# EAGLE design veils_v40 (EAGLE 9.7.0)

## Sheet 1 of 5
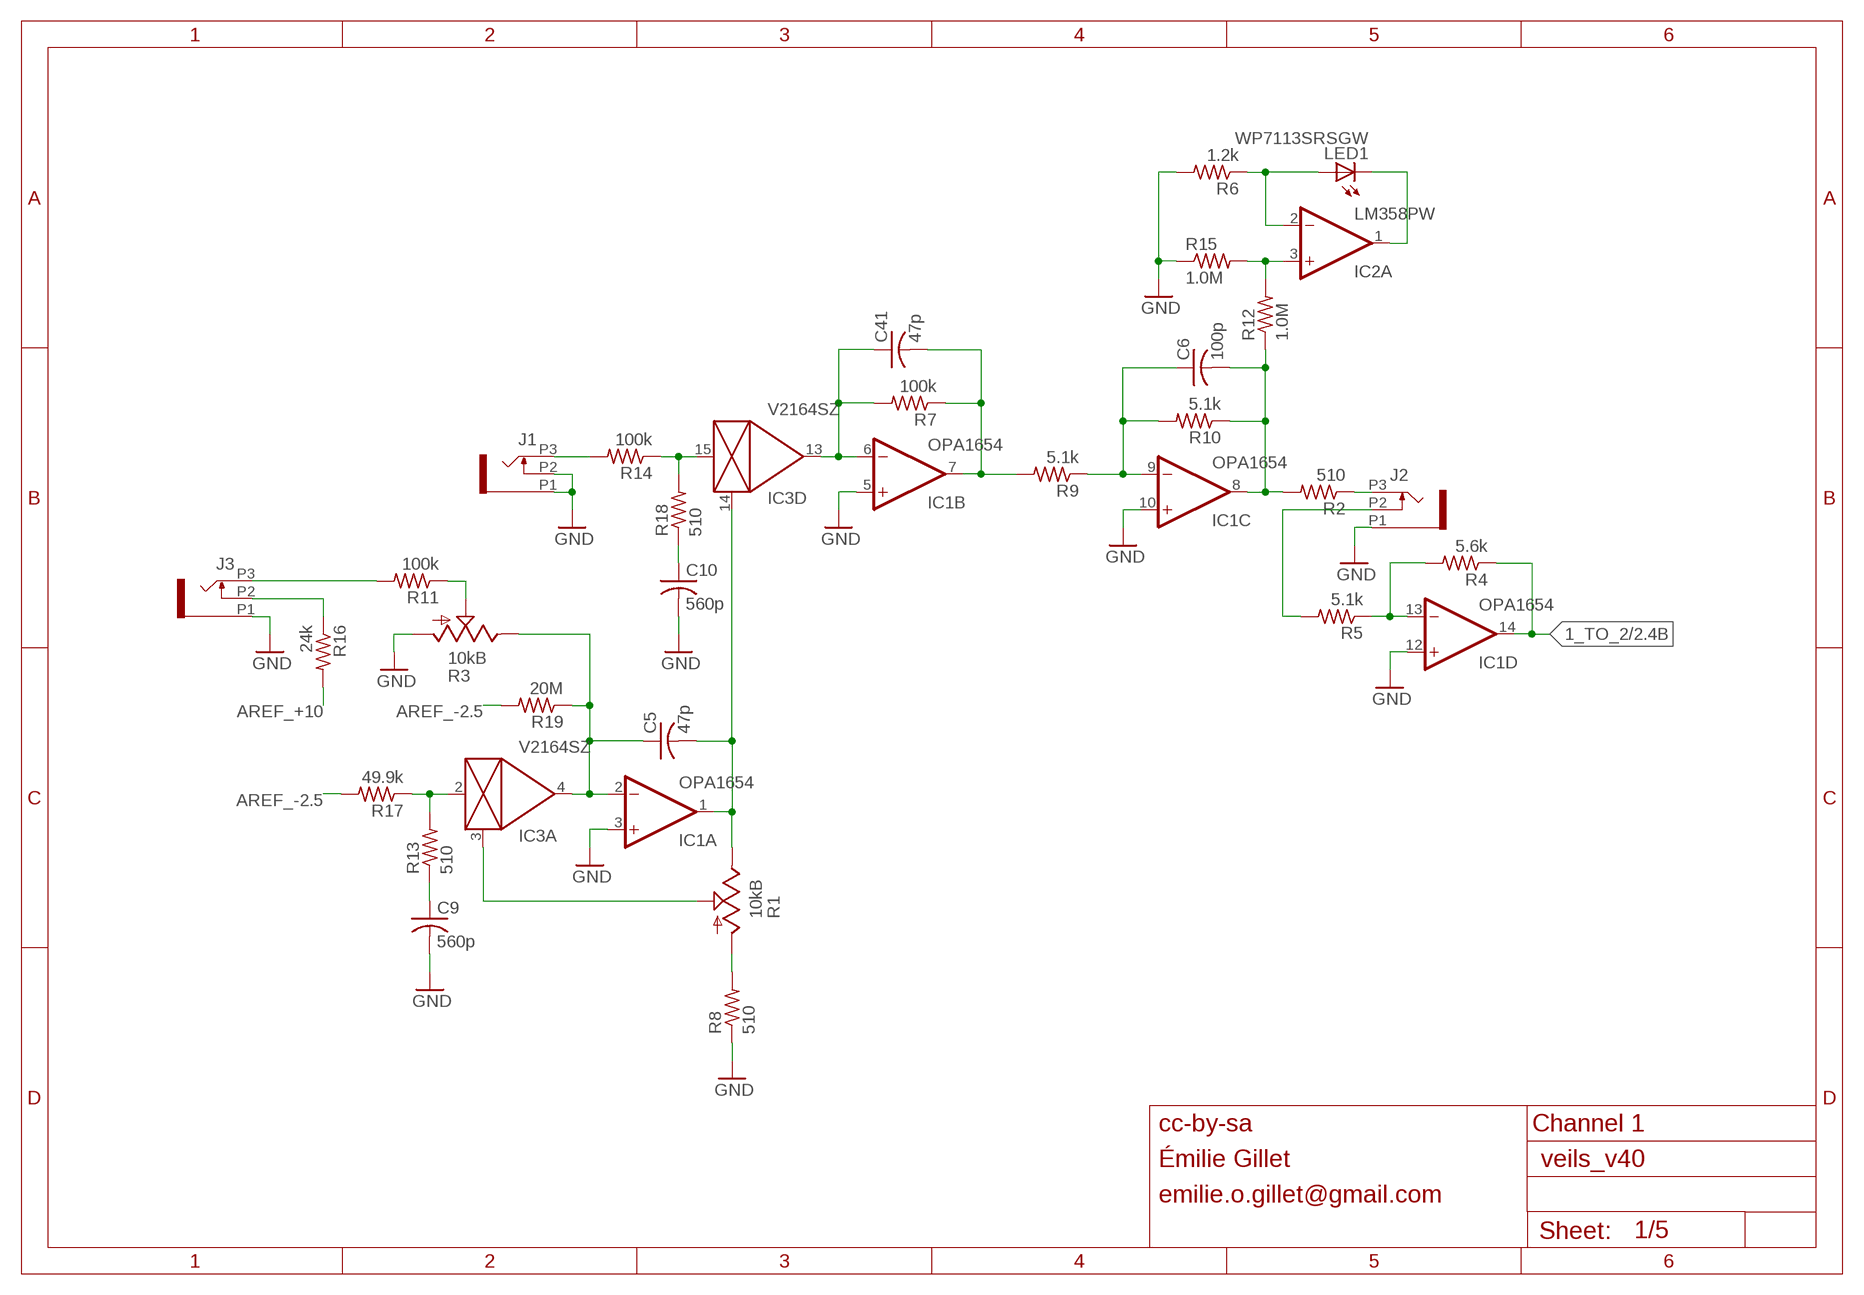
[diagram p0: schematic, sheet 1]

### Parts
C5  47p  C-USC0402  [C0402]
C6  100p  C-USC0402  [C0402]
C9  560p  C-USC0402  [C0402]
C10  560p  C-USC0402  [C0402]
C41  47p  C-USC0402  [C0402]
IC1  OPA1654  TL074PW  [TSSOP14]
IC2  LM358PW  TL072PW  [TSSOP8]
IC3  V2164SZ  SSM2164S  [SOIC16N]
J1  PJ301_THONKICONN6  [WQP_PJ_301M6]
J2  PJ301_THONKICONN6  [WQP_PJ_301M6]
J3  PJ301_THONKICONN6  [WQP_PJ_301M6]
LED1  WP7113SRSGW  LED5MM  [LED5MM]
R1  10kB  POT_USVERTICAL  [ALPS_POT_VERTICAL]
R2  510  R-US_R0402  [R0402]
R3  10kB  POT_USVERTICAL_PS  [ALPS_POT_VERTICAL_PS]
R4  5.6k  R-US_R0402  [R0402]
R5  5.1k  R-US_R0402  [R0402]
R6  1.2k  R-US_R0402  [R0402]
R7  100k  R-US_R0402  [R0402]
R8  510  R-US_R0402  [R0402]
R9  5.1k  R-US_R0402  [R0402]
R10  5.1k  R-US_R0402  [R0402]
R11  100k  R-US_R0402  [R0402]
R12  1.0M  R-US_R0402  [R0402]
R13  510  R-US_R0402  [R0402]
R14  100k  R-US_R0402  [R0402]
R15  1.0M  R-US_R0402  [R0402]
R16  24k  R-US_R0402  [R0402]
R17  49.9k  R-US_R0402  [R0402]
R18  510  R-US_R0402  [R0402]
R19  20M  R-US_R0402  [R0402]

### Nets
1_TO_2: IC1.14(D:OUT) R4.1 ; also sheet 2
AREF_+10: R16.2 ; also sheet 2,3,4,5
AREF_-2.5: R17.2 R19.2 ; also sheet 2,3,4,5
CV_IN_1: J3.P3 R11.2
FOO: IC3.2(A:IN) R13.2 R17.1
GND: C9.2 C10.2 IC1.3(A:+IN) IC1.5(B:+IN) IC1.10(C:+IN) IC1.12(D:+IN) J1.P1 J1.P2 J2.P1 J3.P1 R3.P$3(A) R6.2 R8.1 R15.1 ; also sheet 2,3,4,5
N$1: IC2.3(A:+IN) R12.2 R15.2
N$7: J2.P3 R2.1
N$9: IC3.3(A:CTRL) R1.P$2(S)
N$10: C6.1 IC1.9(C:-IN) R9.1 R10.2
N$14: R3.P$2(S) R11.1
N$15: R1.P$3(A) R8.2
N$18: IC2.1(A:OUT) LED1.K(C)
N$19: IC2.2(A:-IN) LED1.A R6.1
N$20: C9.1 R13.1
N$21: J3.P2 R16.1
N$22: IC1.13(D:-IN) R4.2 R5.1
N$25: J2.P2 R5.2
N$47: C10.1 R18.1
N$65: C5.1 IC1.2(A:-IN) IC3.4(A:OUT) R3.P$1(E) R19.1
N$66: J1.P3 R14.2
N$75: IC3.15(D:IN) R14.1 R18.2
N$87: C5.2 IC1.1(A:OUT) IC3.14(D:CTRL) R1.P$1(E)
N$96: C41.1 IC1.6(B:-IN) IC3.13(D:OUT) R7.2
N$100: C41.2 IC1.7(B:OUT) R7.1 R9.2
OUT1: C6.2 IC1.8(C:OUT) R2.2 R10.1 R12.1

### Notes on the sheet
- cc-by-sa | Channel 1
- Émilie Gillet
- emilie.o.gillet@gmail.com

## Sheet 2 of 5
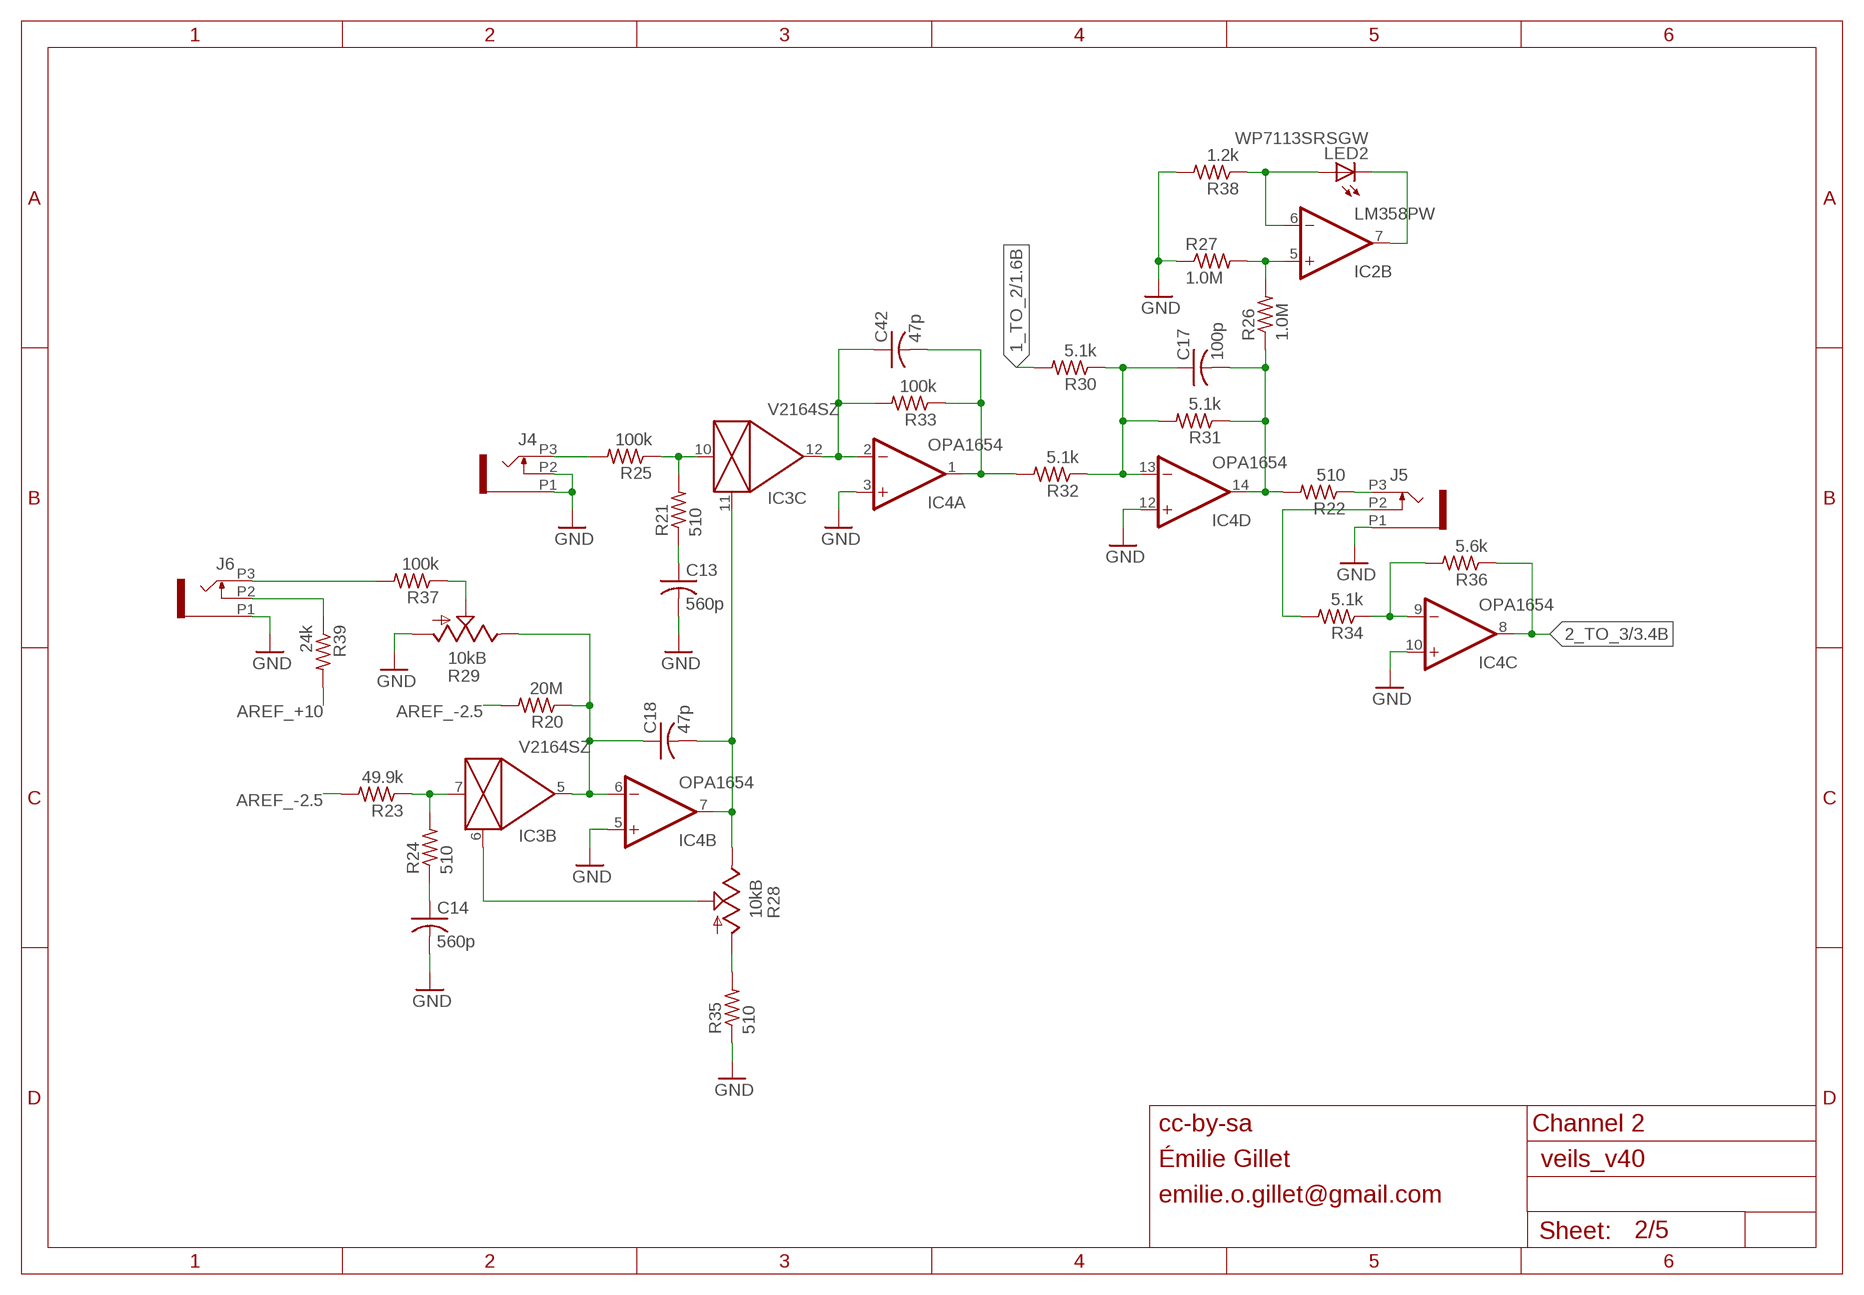
[diagram p1: schematic, sheet 2]

### Parts
C13  560p  C-USC0402  [C0402]
C14  560p  C-USC0402  [C0402]
C17  100p  C-USC0402  [C0402]
C18  47p  C-USC0402  [C0402]
C42  47p  C-USC0402  [C0402]
IC4  OPA1654  TL074PW  [TSSOP14]
J4  PJ301_THONKICONN6  [WQP_PJ_301M6]
J5  PJ301_THONKICONN6  [WQP_PJ_301M6]
J6  PJ301_THONKICONN6  [WQP_PJ_301M6]
LED2  WP7113SRSGW  LED5MM  [LED5MM]
R20  20M  R-US_R0402  [R0402]
R21  510  R-US_R0402  [R0402]
R22  510  R-US_R0402  [R0402]
R23  49.9k  R-US_R0402  [R0402]
R24  510  R-US_R0402  [R0402]
R25  100k  R-US_R0402  [R0402]
R26  1.0M  R-US_R0402  [R0402]
R27  1.0M  R-US_R0402  [R0402]
R28  10kB  POT_USVERTICAL  [ALPS_POT_VERTICAL]
R29  10kB  POT_USVERTICAL_PS  [ALPS_POT_VERTICAL_PS]
R30  5.1k  R-US_R0402  [R0402]
R31  5.1k  R-US_R0402  [R0402]
R32  5.1k  R-US_R0402  [R0402]
R33  100k  R-US_R0402  [R0402]
R34  5.1k  R-US_R0402  [R0402]
R35  510  R-US_R0402  [R0402]
R36  5.6k  R-US_R0402  [R0402]
R37  100k  R-US_R0402  [R0402]
R38  1.2k  R-US_R0402  [R0402]
R39  24k  R-US_R0402  [R0402]

### Nets
1_TO_2: R30.2 ; also sheet 1
2_TO_3: IC4.8(C:OUT) R36.1 ; also sheet 3
AREF_+10: R39.2 ; also sheet 1,3,4,5
AREF_-2.5: R20.2 R23.2 ; also sheet 1,3,4,5
FOO1: IC3.7(B:IN) R23.1 R24.2
GND: C13.2 C14.2 IC4.3(A:+IN) IC4.5(B:+IN) IC4.10(C:+IN) IC4.12(D:+IN) J4.P1 J4.P2 J5.P1 J6.P1 R27.1 R29.P$3(A) R35.1 R38.2 ; also sheet 1,3,4,5
N$3: J4.P3 R25.2
N$4: IC2.5(B:+IN) R26.2 R27.2
N$6: J5.P3 R22.1
N$17: C13.1 R21.1
N$24: IC3.10(C:IN) R21.2 R25.1
N$26: IC3.6(B:CTRL) R28.P$2(S)
N$27: C17.1 IC4.13(D:-IN) R30.1 R31.2 R32.1
N$28: C18.2 IC3.11(C:CTRL) IC4.7(B:OUT) R28.P$1(E)
N$32: R28.P$3(A) R35.2
N$35: IC2.7(B:OUT) LED2.K(C)
N$36: IC2.6(B:-IN) LED2.A R38.1
N$37: IC4.9(C:-IN) R34.1 R36.2
N$38: J5.P2 R34.2
N$39: C42.2 IC4.1(A:OUT) R32.2 R33.1
N$40: R29.P$2(S) R37.1
N$41: C14.1 R24.1
N$42: C18.1 IC3.5(B:OUT) IC4.6(B:-IN) R20.1 R29.P$1(E)
N$44: J6.P3 R37.2
N$53: C42.1 IC3.12(C:OUT) IC4.2(A:-IN) R33.2
N$64: J6.P2 R39.1
OUT2: C17.2 IC4.14(D:OUT) R22.2 R26.1 R31.1

### Notes on the sheet
- cc-by-sa | Channel 2
- Émilie Gillet
- emilie.o.gillet@gmail.com

## Sheet 3 of 5
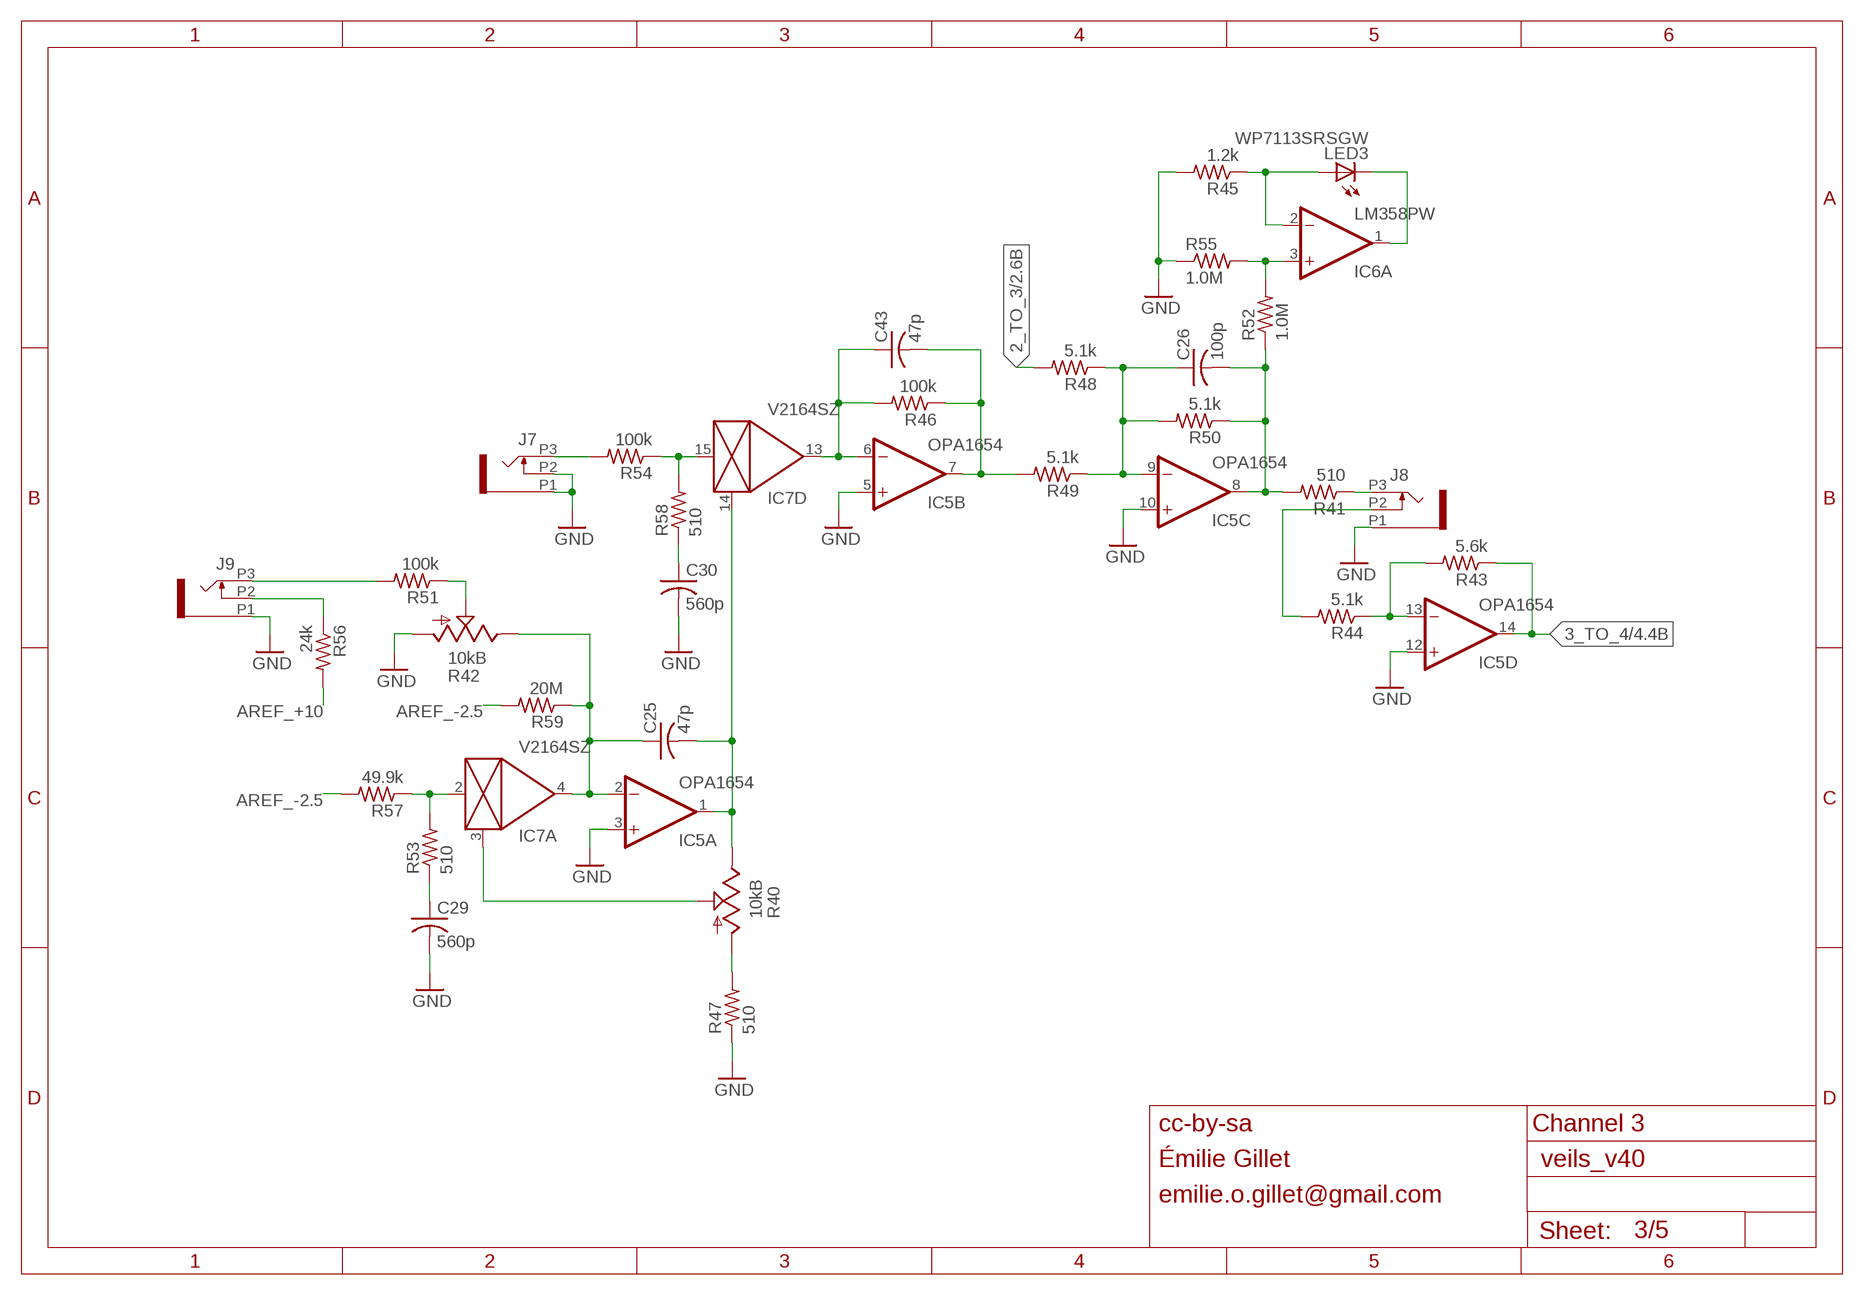
[diagram p2: schematic, sheet 3]

### Parts
C25  47p  C-USC0402  [C0402]
C26  100p  C-USC0402  [C0402]
C29  560p  C-USC0402  [C0402]
C30  560p  C-USC0402  [C0402]
C43  47p  C-USC0402  [C0402]
IC5  OPA1654  TL074PW  [TSSOP14]
IC6  LM358PW  TL072PW  [TSSOP8]
IC7  V2164SZ  SSM2164S  [SOIC16N]
J7  PJ301_THONKICONN6  [WQP_PJ_301M6]
J8  PJ301_THONKICONN6  [WQP_PJ_301M6]
J9  PJ301_THONKICONN6  [WQP_PJ_301M6]
LED3  WP7113SRSGW  LED5MM  [LED5MM]
R40  10kB  POT_USVERTICAL  [ALPS_POT_VERTICAL]
R41  510  R-US_R0402  [R0402]
R42  10kB  POT_USVERTICAL_PS  [ALPS_POT_VERTICAL_PS]
R43  5.6k  R-US_R0402  [R0402]
R44  5.1k  R-US_R0402  [R0402]
R45  1.2k  R-US_R0402  [R0402]
R46  100k  R-US_R0402  [R0402]
R47  510  R-US_R0402  [R0402]
R48  5.1k  R-US_R0402  [R0402]
R49  5.1k  R-US_R0402  [R0402]
R50  5.1k  R-US_R0402  [R0402]
R51  100k  R-US_R0402  [R0402]
R52  1.0M  R-US_R0402  [R0402]
R53  510  R-US_R0402  [R0402]
R54  100k  R-US_R0402  [R0402]
R55  1.0M  R-US_R0402  [R0402]
R56  24k  R-US_R0402  [R0402]
R57  49.9k  R-US_R0402  [R0402]
R58  510  R-US_R0402  [R0402]
R59  20M  R-US_R0402  [R0402]

### Nets
2_TO_3: R48.2 ; also sheet 2
3_TO_4: IC5.14(D:OUT) R43.1 ; also sheet 4
AREF_+10: R56.2 ; also sheet 1,2,4,5
AREF_-2.5: R57.2 R59.2 ; also sheet 1,2,4,5
FOO2: IC7.2(A:IN) R53.2 R57.1
GND: C29.2 C30.2 IC5.3(A:+IN) IC5.5(B:+IN) IC5.10(C:+IN) IC5.12(D:+IN) J7.P1 J7.P2 J8.P1 J9.P1 R42.P$3(A) R45.2 R47.1 R55.1 ; also sheet 1,2,4,5
N$5: IC6.3(A:+IN) R52.2 R55.2
N$23: J8.P3 R41.1
N$29: IC7.3(A:CTRL) R40.P$2(S)
N$30: C25.2 IC5.1(A:OUT) IC7.14(D:CTRL) R40.P$1(E)
N$34: R40.P$3(A) R47.2
N$45: C30.1 R58.1
N$46: IC7.15(D:IN) R54.1 R58.2
N$49: C26.1 IC5.9(C:-IN) R48.1 R49.1 R50.2
N$50: J9.P2 R56.1
N$52: J7.P3 R54.2
N$55: J9.P3 R51.2
N$56: C43.1 IC5.6(B:-IN) IC7.13(D:OUT) R46.2
N$58: IC6.1(A:OUT) LED3.K(C)
N$59: IC6.2(A:-IN) LED3.A R45.1
N$60: IC5.13(D:-IN) R43.2 R44.1
N$61: J8.P2 R44.2
N$63: C29.1 R53.1
N$67: C25.1 IC5.2(A:-IN) IC7.4(A:OUT) R42.P$1(E) R59.1
N$70: R42.P$2(S) R51.1
N$103: C43.2 IC5.7(B:OUT) R46.1 R49.2
OUT3: C26.2 IC5.8(C:OUT) R41.2 R50.1 R52.1

### Notes on the sheet
- cc-by-sa | Channel 3
- Émilie Gillet
- emilie.o.gillet@gmail.com

## Sheet 4 of 5
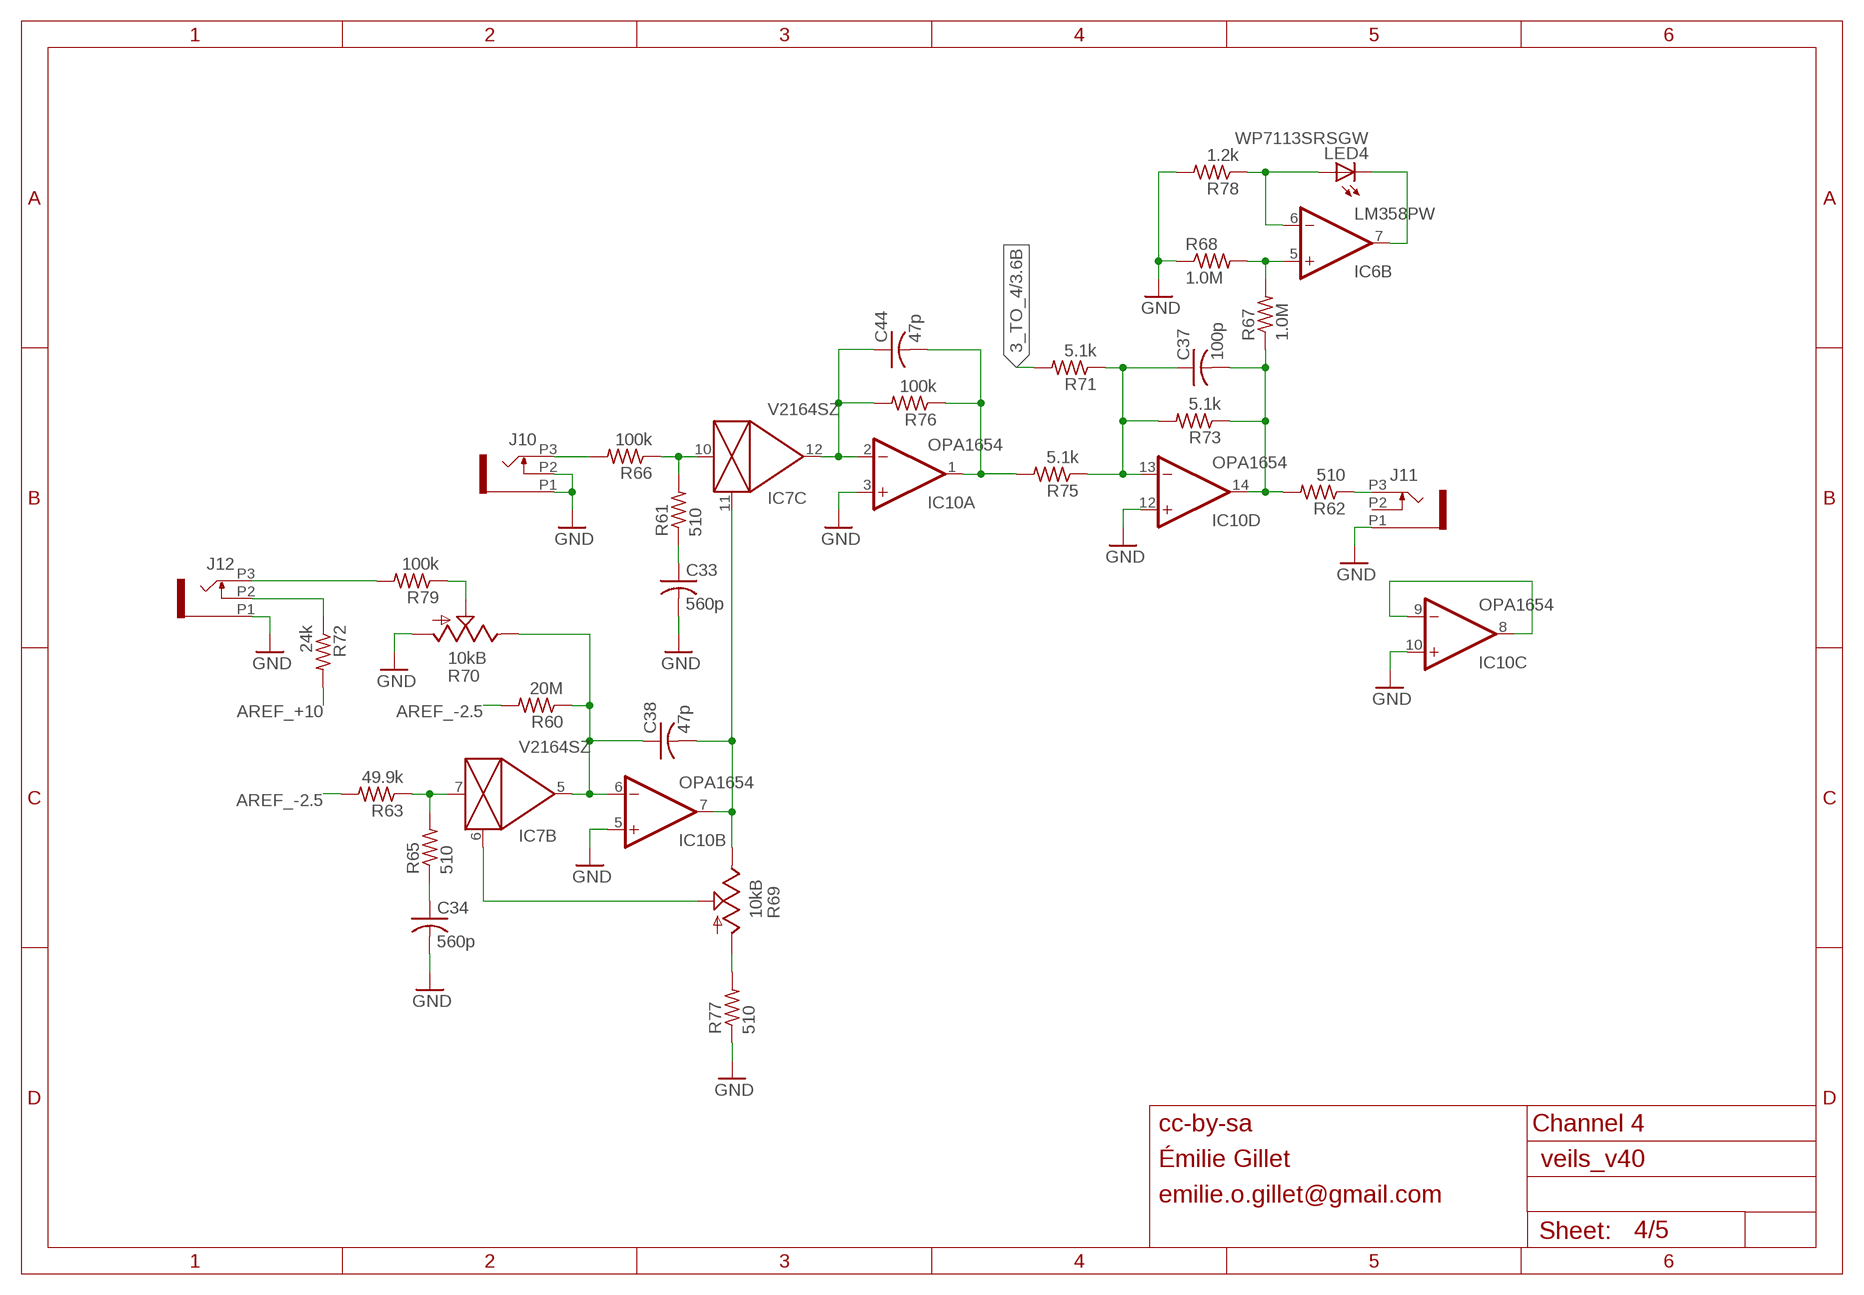
[diagram p3: schematic, sheet 4]

### Parts
C33  560p  C-USC0402  [C0402]
C34  560p  C-USC0402  [C0402]
C37  100p  C-USC0402  [C0402]
C38  47p  C-USC0402  [C0402]
C44  47p  C-USC0402  [C0402]
IC10  OPA1654  TL074PW  [TSSOP14]
J10  PJ301_THONKICONN6  [WQP_PJ_301M6]
J11  PJ301_THONKICONN6  [WQP_PJ_301M6]
J12  PJ301_THONKICONN6  [WQP_PJ_301M6]
LED4  WP7113SRSGW  LED5MM  [LED5MM]
R60  20M  R-US_R0402  [R0402]
R61  510  R-US_R0402  [R0402]
R62  510  R-US_R0402  [R0402]
R63  49.9k  R-US_R0402  [R0402]
R65  510  R-US_R0402  [R0402]
R66  100k  R-US_R0402  [R0402]
R67  1.0M  R-US_R0402  [R0402]
R68  1.0M  R-US_R0402  [R0402]
R69  10kB  POT_USVERTICAL  [ALPS_POT_VERTICAL]
R70  10kB  POT_USVERTICAL_PS  [ALPS_POT_VERTICAL_PS]
R71  5.1k  R-US_R0402  [R0402]
R72  24k  R-US_R0402  [R0402]
R73  5.1k  R-US_R0402  [R0402]
R75  5.1k  R-US_R0402  [R0402]
R76  100k  R-US_R0402  [R0402]
R77  510  R-US_R0402  [R0402]
R78  1.2k  R-US_R0402  [R0402]
R79  100k  R-US_R0402  [R0402]

### Nets
3_TO_4: R71.2 ; also sheet 3
AREF_+10: R72.2 ; also sheet 1,2,3,5
AREF_-2.5: R60.2 R63.2 ; also sheet 1,2,3,5
FOO3: IC7.7(B:IN) R63.1 R65.2
GND: C33.2 C34.2 IC10.3(A:+IN) IC10.5(B:+IN) IC10.10(C:+IN) IC10.12(D:+IN) J10.P1 J10.P2 J11.P1 J12.P1 R68.1 R70.P$3(A) R77.1 R78.2 ; also sheet 1,2,3,5
N$2: IC10.8(C:OUT) IC10.9(C:-IN)
N$8: IC6.5(B:+IN) R67.2 R68.2
N$33: C38.2 IC7.11(C:CTRL) IC10.7(B:OUT) R69.P$1(E)
N$43: IC7.6(B:CTRL) R69.P$2(S)
N$51: R69.P$3(A) R77.2
N$62: C44.1 IC7.12(C:OUT) IC10.2(A:-IN) R76.2
N$69: J10.P3 R66.2
N$71: J11.P3 R62.1
N$72: C33.1 R61.1
N$73: IC7.10(C:IN) R61.2 R66.1
N$76: C37.1 IC10.13(D:-IN) R71.1 R73.2 R75.1
N$77: J12.P3 R79.2
N$84: IC6.7(B:OUT) LED4.K(C)
N$85: IC6.6(B:-IN) LED4.A R78.1
N$88: C44.2 IC10.1(A:OUT) R75.2 R76.1
N$89: R70.P$2(S) R79.1
N$90: C34.1 R65.1
N$91: C38.1 IC7.5(B:OUT) IC10.6(B:-IN) R60.1 R70.P$1(E)
N$105: J12.P2 R72.1
OUT4: C37.2 IC10.14(D:OUT) R62.2 R67.1 R73.1
Unconnected: J11.P2

### Notes on the sheet
- cc-by-sa | Channel 4
- Émilie Gillet
- emilie.o.gillet@gmail.com

## Sheet 5 of 5
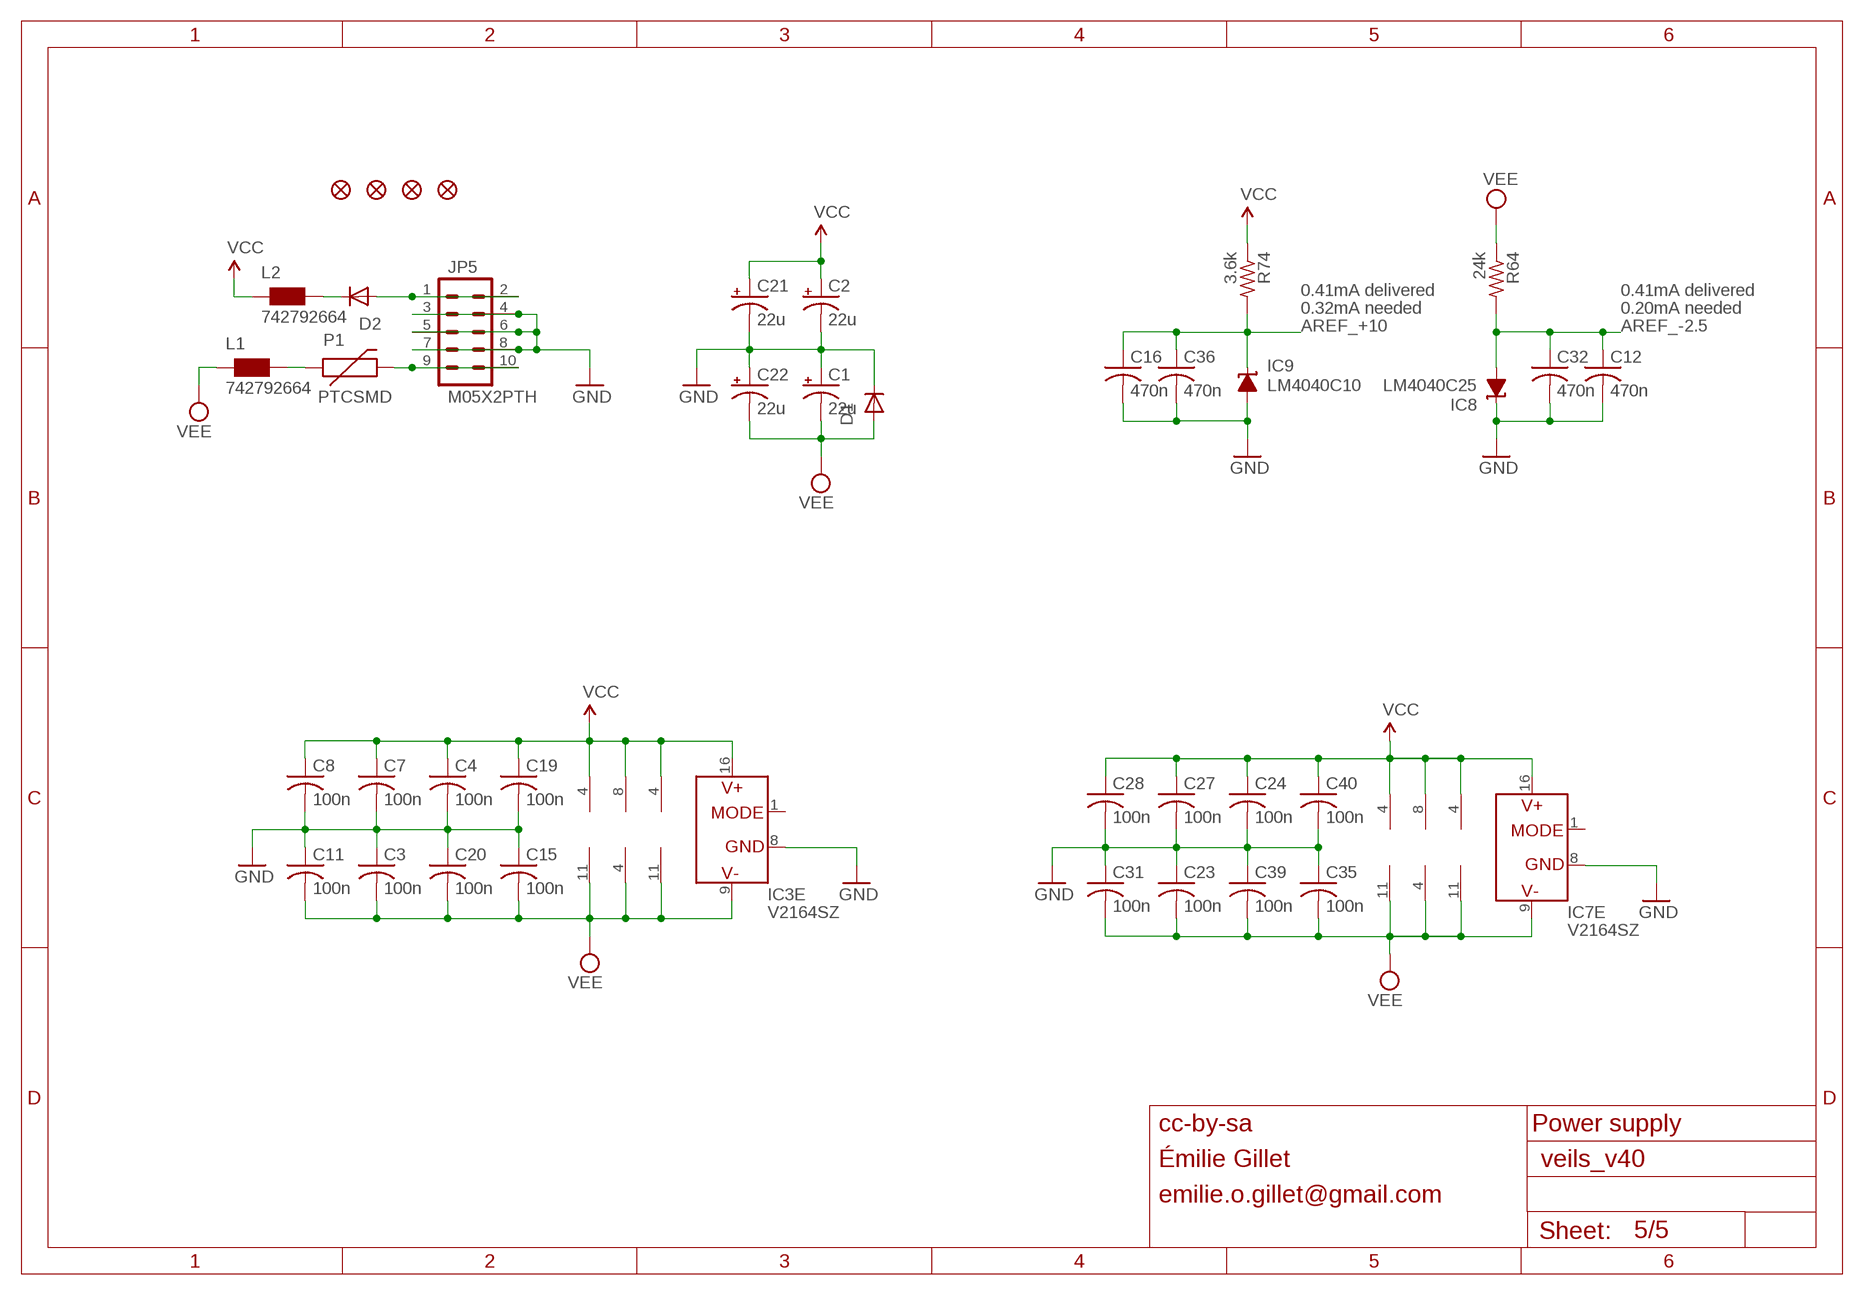
[diagram p4: schematic, sheet 5]

### Parts
C1  22u  CPOL-USB  [PANASONIC_B]
C2  22u  CPOL-USB  [PANASONIC_B]
C3  100n  C-USC0402  [C0402]
C4  100n  C-USC0402  [C0402]
C7  100n  C-USC0402  [C0402]
C8  100n  C-USC0402  [C0402]
C11  100n  C-USC0402  [C0402]
C12  470n  C-USC0402  [C0402]
C15  100n  C-USC0402  [C0402]
C16  470n  C-USC0402  [C0402]
C19  100n  C-USC0402  [C0402]
C20  100n  C-USC0402  [C0402]
C21  22u  CPOL-USB  [PANASONIC_B]
C22  22u  CPOL-USB  [PANASONIC_B]
C23  100n  C-USC0402  [C0402]
C24  100n  C-USC0402  [C0402]
C27  100n  C-USC0402  [C0402]
C28  100n  C-USC0402  [C0402]
C31  100n  C-USC0402  [C0402]
C32  470n  C-USC0402  [C0402]
C35  100n  C-USC0402  [C0402]
C36  470n  C-USC0402  [C0402]
C39  100n  C-USC0402  [C0402]
C40  100n  C-USC0402  [C0402]
D1  1N5819HW  DIODE-SOD123  [SOD123]
D2  1N5819HW  DIODE-SOD123  [SOD123]
IC8  LM4040C25  LM4041B12DBZ  [DBZ_R-PDSO-G3]
IC9  LM4040C10  LM4041B12DBZ  [DBZ_R-PDSO-G3]
JP1  FIDUCIAL1X2  [FIDUCIAL-1X2]
JP2  FIDUCIAL1X2  [FIDUCIAL-1X2]
JP3  FIDUCIAL1X2  [FIDUCIAL-1X2]
JP4  FIDUCIAL1X2  [FIDUCIAL-1X2]
JP5  M05X2PTH  [AVR_ICSP]
L1  742792664  WE-CBF_0603  [0603]
L2  742792664  WE-CBF_0603  [0603]
P1  PTCSMD  [PTC-1206]
R64  24k  R-US_R0402  [R0402]
R74  3.6k  R-US_R0402  [R0402]

### Nets
AREF_+10: C16.1 C36.1 IC9.1(C) R74.2 ; also sheet 1,2,3,4
AREF_-2.5: C12.1 C32.1 IC8.2(A) R64.2 ; also sheet 1,2,3,4
GND: C1.+ C2.- C3.1 C4.2 C7.2 C8.2 C11.1 C12.2 C15.1 C16.2 C19.2 C20.1 C21.- C22.+ C23.1 C24.2 C27.2 C28.2 C31.1 C32.2 C35.1 C36.2 C39.1 C40.2 D1.C IC3.8(E:GND) IC7.8(E:GND) IC8.1(C) IC9.2(A) JP5.3 JP5.4 JP5.5 JP5.6 JP5.7 JP5.8 ; also sheet 1,2,3,4
N$11: D2.A JP5.1 JP5.2
N$12: JP5.9 JP5.10 P1.2
N$13: L1.2 P1.1
N$16: D2.C L2.2
VCC: C2.+ C4.1 C7.1 C8.1 C19.1 C21.+ C24.1 C27.1 C28.1 C40.1 IC1.4(P:V+) IC2.8(P:V+) IC3.16(E:V+) IC4.4(P:V+) IC5.4(P:V+) IC6.8(P:V+) IC7.16(E:V+) IC10.4(P:V+) L2.1 R74.1
VEE: C1.- C3.2 C11.2 C15.2 C20.2 C22.- C23.2 C31.2 C35.2 C39.2 D1.A IC1.11(P:V-) IC2.4(P:V-) IC3.9(E:V-) IC4.11(P:V-) IC5.11(P:V-) IC6.4(P:V-) IC7.9(E:V-) IC10.11(P:V-) L1.1 R64.1
Unconnected: IC3.1(E:MODE) IC7.1(E:MODE)

### Notes on the sheet
- 0.41mA delivered | 0.41mA delivered
- 0.32mA needed | 0.20mA needed
- cc-by-sa | Power supply
- Émilie Gillet
- emilie.o.gillet@gmail.com

## Library data of the parts
C1 C2 C21 C22 = rcl:CPOL-US: POLARIZED CAPACITOR, American symbol
C3-C20 C23-C44 = rcl:C-US: CAPACITOR, American symbol
D1 D2 = diode:DIODE-: DIODE
IC1 IC4 IC5 IC10 = linear:TL074: OP AMP
IC2 IC6 = linear:TL072: OP AMP
IC3 IC7 = ssm2164:SSM2164
IC8 IC9 = texas:LM4041: PRECISION MICROPOWER SHUNT VOLTAGE REFERENCE Source: http://focus.ti.com/lit/ds/slcs146e/slcs146e.pdf
J1-J12 = og-pj301:PJ301_THONKICONN
JP1-JP4 = SparkFun:FIDUCIAL: Fiducial Alignment Points Various fiducial points for machine vision alignment.
JP5 = og-header:M05X2: Header 5x2 Standard 10-pin dual row 0.1" header. Commonly used with AVR-ISP. Use with Spark Fun Electronics SKU: PRT-00778
L1 L2 = wuerth-elektronik:WE-CBF: SMD EMI Suppression Ferrite Beads - excellent anti-EMI properties - low DCR - impedances till 3000 ohms - rated current up to 6 A
LED1-LED4 = led:LED: LED OSRAM: - CHIPLED LG R971, LG N971, LY N971, LG Q971, LY Q971, LO R971, LY R971 LH N974, LH R974 LS Q976, LO Q976, LY Q976 LO Q996 - Hyper CHIPLED LW Q18S LB Q993, LB Q99A, LB R99A - SideLED LS A670, LO A670, LY A670, LG A670, LP A670 LB A673, LV A673, LT A673, LW A673 LH A674 LY A675 LS A676, LA A676, LO A676, LY A676, LW A676 LS A679, LY A679, LG A679 - Hyper Micro SIDELED® LS Y876, LA Y876, LO Y876, LY Y876 LT Y87S - SmartLED LW L88C, LW L88S LB L89C, LB L89S, LG L890 LS L89K, LO L89K, LY L89K LS L896, LA L896, LO L896, LY L896 - TOPLED LS T670, LO T670, LY T670, LG T670, LP T670 LSG T670, LSP T670, LSY T670, LOP T670, LYG T670 LG T671, LOG T671, LSG T671 LB T673, LV T673, LT T673, LW T673 LH T674 LS T676, LA T676, LO T676, LY T676, LB T676, LH T676, LSB T676, LW T676 LB T67C, LV T67C, LT T67C, LS T67K, LO T67K, LY T67K, LW E67C LS E67B, LA E67B, LO E67B, LY E67B, LB E67C, LV E67C, LT E67C LW T67C LS T679, LY T679, LG T679 LS T770, LO T770, LY T770, LG T770, LP T770 LB T773, LV T773, LT T773, LW T773 LH T774 LS E675, LA E675, LY E675, LS T675 LS T776, LA T776, LO T776, LY T776, LB T776 LHGB T686 LT T68C, LB T68C - Hyper Mini TOPLED® LB M676 - Mini TOPLED Santana® LG M470 LS M47K, LO M47K, LY M47K Source: http://www.osram.convergy.de LUXEON: - LUMILED® LXK2-PW12-R00, LXK2-PW12-S00, LXK2-PW14-U00, LXK2-PW14-V00 LXK2-PM12-R00, LXK2-PM12-S00, LXK2-PM14-U00 LXK2-PE12-Q00, LXK2-PE12-R00, LXK2-PE12-S00, LXK2-PE14-T00, LXK2-PE14-U00 LXK2-PB12-K00, LXK2-PB12-L00, LXK2-PB12-M00, LXK2-PB14-N00, LXK2-PB14-P00, LXK2-PB14-Q00 LXK2-PR12-L00, LXK2-PR12-M00, LXK2-PR14-Q00, LXK2-PR14-R00 LXK2-PD12-Q00, LXK2-PD12-R00, LXK2-PD12-S00 LXK2-PH12-R00, LXK2-PH12-S00 LXK2-PL12-P00, LXK2-PL12-Q00, LXK2-PL12-R00 Source: www.luxeon.com KINGBRIGHT: KA-3528ASYC Source: www.kingbright.com
P1 = SparkFun:PTC: Resettable Fuse PTC Resettable Fuse. Spark Fun Electronics SKU : COM-08357
R1 R28 R40 R69 = og-pots:POT_US
R2 R4-R27 R30-R39 R41 R43-R68 R71-R79 = rcl:R-US_: RESISTOR, American symbol
R3 R29 R42 R70 = pot-alps:POT_US

## Board
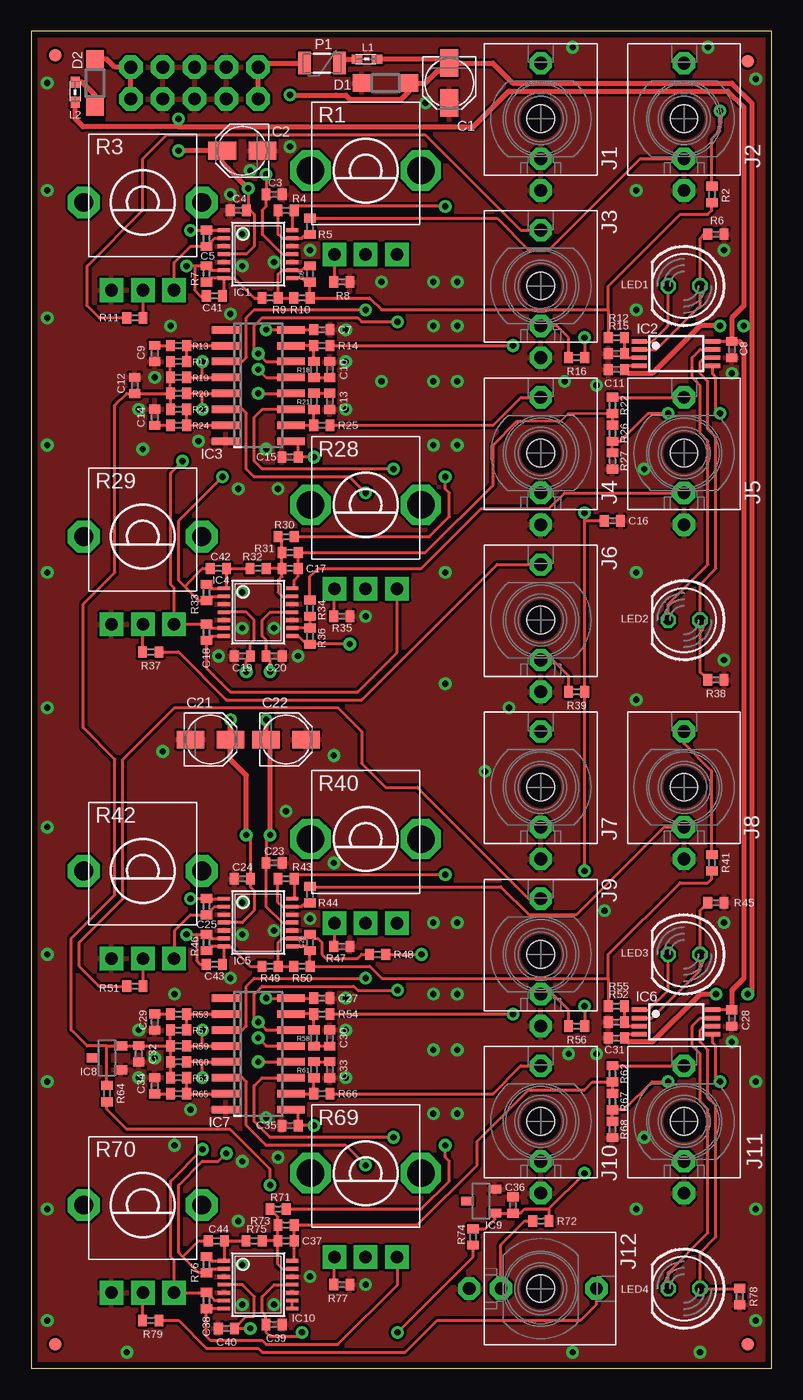
[diagram p5: board, top side]
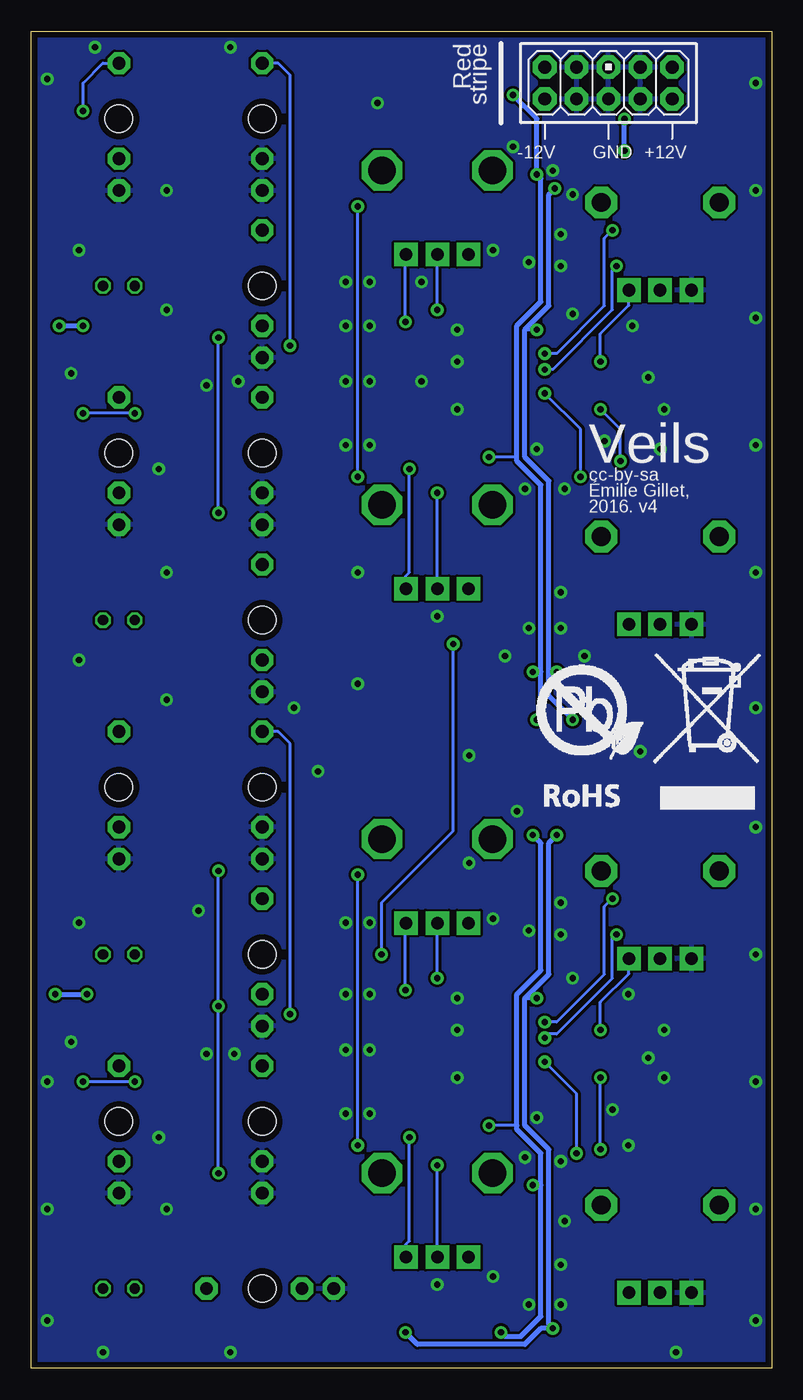
[diagram p6: board, bottom side, seen from below]

Size 59.05 x 106.68 mm. Coordinates in mm from the lower left corner, seen from the top.
Outline: 0,0 59.05,0 59.05,106.68 0,106.68 0,0
Copper layers (1*16): Top 0.035mm / dielectric 1.5mm / Bottom 0.035mm
Design rules "PCBCart-Standard": minimum track width 8mil, minimum drill 0.4mm, track to track 8mil, track to pad 8mil, pad to pad 8mil, via to via 8mil, smd to smd 8mil, copper to edge 20mil, drill to drill 8mil, minimum pad ring 8mil, minimum via ring 10mil, stop-mask expansion 3mil, vias tented up to drill 25mil, thermal gap 8mil

### Footprints (pad centres in the part's own frame; a part is rotated, then mirrored left to right if it is on the bottom)
PANASONIC_B = smd 2.2 x 1.4: + 1.6,0; - -1.6,0
C0402 = smd 0.7 x 0.9: 1 -0.65,0; 2 0.65,0
SOD123 = smd 1.4 x 1.4: A 1.9,0; C -1.9,0
TSSOP14 = smd 0.305 x 0.991: 1 -1.905,-2.718; 2 -1.27,-2.718; 3 -0.635,-2.718; 4 0,-2.718; 5 0.635,-2.718; 6 1.27,-2.718; 7 1.905,-2.718; 8 1.905,2.718; 9 1.27,2.718; 10 0.635,2.718; 11 0,2.718; 12 -0.635,2.718; 13 -1.27,2.718; 14 -1.905,2.718
TSSOP8 = smd 0.35 x 1.2: 1 -0.975,-2.925; 2 -0.325,-2.925; 3 0.325,-2.925; 4 0.975,-2.925; 5 0.975,2.925; 6 0.325,2.925; 7 -0.325,2.925; 8 -0.975,2.925
SOIC16N = smd 0.6 x 2.2: 1 -4.445,-2.6; 2 -3.175,-2.6; 3 -1.905,-2.6; 4 -0.635,-2.6; 5 0.635,-2.6; 6 1.905,-2.6; 7 3.175,-2.6; 8 4.445,-2.6; 9 4.445,2.6; 10 3.175,2.6; 11 1.905,2.6; 12 0.635,2.6; 13 -0.635,2.6; 14 -1.905,2.6; 15 -3.175,2.6; 16 -4.445,2.6
DBZ_R-PDSO-G3 = smd 0.7 x 1: 1 -0.95,-1.1; 2 0.95,-1.1; 3 0,1.1
WQP_PJ_301M6 = drill 1.016 pad 1.778 octagon: P1 0,-5.715; P2 0,-3.175; P3 0,4.445 | hole 2.2: 0,0
FIDUCIAL-1X2 = smd 1 x 1: 1 0,0
AVR_ICSP = drill 1.016 pad 1.88 octagon: 1 -1.27,5.08; 2 1.27,5.08; 3 -1.27,2.54; 4 1.27,2.54; 5 -1.27,0; 6 1.27,0; 7 -1.27,-2.54; 8 1.27,-2.54; 9 -1.27,-5.08; 10 1.27,-5.08
0603 = smd 0.85 x 0.7: 1 -0.9,0; 2 0.7,0
LED5MM = drill 0.813 octagon: A -1.27,0; K 1.27,0
PTC-1206 = smd 1 x 1.8: 1 -1.4,0; 2 1.4,0
ALPS_POT_VERTICAL = drill 1 pad 1.88 square: P$1 -2.5,6.7; P$2 0,6.7; P$3 2.5,6.7 | drill 2.2 pad 3.175 octagon: P$4 -4.4,0; P$5 4.4,0
R0402 = smd 0.7 x 0.9: 1 -0.65,0; 2 0.65,0
ALPS_POT_VERTICAL_PS = drill 1 pad 1.88 square: P$1 -2.5,7; P$2 0,7; P$3 2.5,7 | drill 1.5 pad 2.54 octagon: P$4 -4.7,0; P$5 4.7,0

### Placement (x,y rotation side)
C1  33.34,102.55 270 top
C2  16.83,97.16 180 top
C3  19.37,93.66 180 top
C4  16.51,92.39 180 top
C5  13.97,90.17 90 top
C6  22.23,87.31 270 top
C7  23.18,82.87 0 top
C8  55.88,81.28 270 top
C9  9.84,80.96 270 top
C10  23.81,79.69 90 top
C11  46.67,79.69 0 top
C12  8.26,78.42 90 top
C13  23.81,77.15 270 top
C14  9.84,75.88 90 top
C15  20.64,72.71 0 top
C16  46.35,67.63 0 top
C17  20.64,63.82 0 top
C18  13.97,58.74 270 top
C19  16.83,56.83 180 top
C20  19.37,56.83 180 top
C21  14.29,50.16 0 top
C22  20.32,50.16 0 top
C23  19.37,40.32 180 top
C24  16.83,39.05 180 top
C25  13.97,36.83 90 top
C26  22.23,33.97 270 top
C27  23.18,29.53 0 top
C28  55.88,27.94 270 top
C29  9.84,27.62 270 top
C30  23.81,26.35 90 top
C31  46.67,26.35 0 top
C32  8.57,25.08 270 top
C33  23.81,23.81 270 top
C34  9.84,22.54 90 top
C35  20.64,19.37 0 top
C36  38.42,13.02 90 top
C37  20.32,10.16 0 top
C38  13.97,5.4 270 top
C39  19.37,3.49 180 top
C40  15.56,3.17 180 top
C41  14.61,85.57 0 top
C42  14.92,63.82 0 top
C43  14.61,32.23 0 top
C44  14.76,10.16 0 top
D1  28.26,102.55 0 top
D2  5.08,102.55 90 top
IC1  18.1,88.9 270 top
IC2  51.44,80.96 270 top
IC3  18.1,78.42 270 top
IC4  18.1,60.33 270 top
IC5  18.1,35.56 270 top
IC6  51.44,27.62 270 top
IC7  18.1,25.08 270 top
IC8  6.03,24.77 90 top
IC9  35.88,13.34 90 top
IC10  18.1,6.67 270 top
J1  40.64,99.69 0 top
J2  52.07,99.69 0 top
J3  40.64,86.36 0 top
J4  40.64,73.03 0 top
J5  52.07,73.03 0 top
J6  40.64,59.69 0 top
J7  40.64,46.35 0 top
J8  52.07,46.35 0 top
J9  40.64,33.02 0 top
J10  40.64,19.68 0 top
J11  52.07,19.68 0 top
J12  40.64,6.35 270 top
JP1  1.91,104.78 0 top
JP2  57.15,104.3 0 top
JP3  1.91,1.91 0 top
JP4  57.15,1.91 0 top
JP5  13.02,102.55 270 bottom
L1  26.67,104.46 180 top
L2  3.49,101.92 90 top
LED1  52.07,86.36 180 top
LED2  52.07,59.69 180 top
LED3  52.07,33.02 180 top
LED4  52.07,6.35 180 top
P1  23.18,104.14 180 top
R1  26.67,95.57 180 top
R2  54.29,93.66 270 top
R3  8.89,93.03 180 top
R4  20.32,92.39 180 top
R5  22.23,91.12 90 top
R6  54.61,90.49 0 top
R7  13.97,87.31 90 top
R8  24.77,86.68 180 top
R9  19.05,85.41 180 top
R10  21.59,85.41 180 top
R11  8.26,83.82 180 top
R12  46.67,82.23 0 top
R13  11.75,81.6 0 top
R14  23.18,81.6 0 top
R15  46.67,80.96 0 top
R16  43.5,80.64 0 top
R17  11.75,80.33 180 top
R18  22.54,79.69 90 top
R19  11.75,79.06 180 top
R20  11.75,77.79 180 top
R21  22.54,77.15 270 top
R22  46.35,76.83 270 top
R23  11.75,76.52 180 top
R24  11.75,75.25 0 top
R25  23.18,75.25 0 top
R26  46.35,74.61 270 top
R27  46.35,72.39 90 top
R28  26.67,68.9 180 top
R29  8.89,66.36 180 top
R30  20.32,66.36 0 top
R31  20.64,65.09 180 top
R32  18.1,63.82 180 top
R33  13.97,61.91 270 top
R34  22.23,60.64 90 top
R35  24.77,60.01 180 top
R36  22.23,58.42 90 top
R37  9.53,57.15 0 top
R38  54.61,54.93 0 top
R39  43.5,53.98 0 top
R40  26.67,42.23 180 top
R41  54.29,40.32 270 top
R42  8.89,39.69 180 top
R43  20.32,39.05 180 top
R44  22.23,37.78 90 top
R45  54.61,37.15 0 top
R46  13.97,33.97 90 top
R47  24.77,33.66 180 top
R48  27.62,33.02 0 top
R49  19.05,32.07 180 top
R50  21.59,32.07 180 top
R51  8.26,30.48 180 top
R52  46.67,28.89 0 top
R53  11.75,28.26 0 top
R54  23.18,28.26 0 top
R55  46.67,27.62 0 top
R56  43.5,27.3 0 top
R57  11.75,26.99 180 top
R58  22.54,26.35 90 top
R59  11.75,25.72 180 top
R60  11.75,24.45 180 top
R61  22.54,23.81 270 top
R62  46.35,23.5 270 top
R63  11.75,23.18 180 top
R64  6.03,21.91 90 top
R65  11.75,21.91 0 top
R66  23.18,21.91 0 top
R67  46.35,21.27 270 top
R68  46.35,19.05 90 top
R69  26.67,15.56 180 top
R70  8.89,13.02 180 top
R71  19.68,12.7 0 top
R72  40.64,11.75 0 top
R73  20.32,11.43 180 top
R74  35.24,10.48 90 top
R75  17.78,10.16 180 top
R76  13.97,8.26 270 top
R77  24.77,6.67 180 top
R78  56.52,5.71 270 top
R79  9.53,3.81 0 top
U$2  [ROHS_BIG]  20,43.81 0 bottom

### Tracks (layer width: path | path; a pad name or v marks a point on that pad's centre or on a via)
1_TO_2  (via drill 0.5)
  Top 0.254: v33.02,92.71 21.29,92.71 R4.1 20.82,92.24 IC1.14 | R30.2 31.75,66.36 33.34,67.94 33.34,69.85 33.02,70.17 v33.02,71.12
  Bottom 0.254: v33.02,71.12 v33.02,92.71
2_TO_3  (via drill 0.5)
  Top 0.254: IC4.8 21.27,58.42 21.92,57.77 R36.1 22.24,57.78 v25.4,57.78 | R48.2 v31.11,33.02
  Bottom 0.254: v31.11,33.02 31.11,37.15 25.4,42.86 v25.4,57.78
3_TO_4  (via drill 0.5)
  Top 0.254: R43.1 20.82,38.9 | R43.1 21.29,39.37 v33.02,39.37 | IC5.14 20.97,37.62 R43.1 | R71.2 31.11,12.7 33.34,14.92 33.34,16.51 33.02,16.83 v33.02,17.78
  Bottom 0.254: v33.02,17.78 v33.02,39.37
AREF_+10  (via drill 0.5)
  Top 0.254: R16.2 44.13,80.66 v44.13,82.23 | 41.27,12.7 39.37,12.7 39.05,12.38 38.43,12.38 C36.1 36.99,12.37 IC9.1 36.98,11.89 36.2,11.11 35.26,11.11 R74.2 | 41.27,12.7 v44.13,15.56 | R72.2 41.27,11.76 41.27,12.7 | 44.13,27.32 44.13,27.3 | 44.13,27.32 R56.2 | v44.13,28.89 44.13,27.32 | C16.1 44.13,67.63 v44.13,68.26 44.13,53.99 R39.2 44.15,39.7 v44.13,39.69
  Bottom 0.254: v44.13,68.26 v44.13,82.23 | v44.13,39.69 v44.13,28.89 v44.13,15.56
AREF_-2.5
  Top 0.254: R17.2 R19.2 R20.2 | R20.2 R23.2 | R20.2 8.27,77.79 C12.1 7.61,77.77 6.67,76.83 6.67,63.5 4.13,60.96 4.13,51.12 6.67,48.58 6.67,37.78 3.17,34.29 3.17,26.99 4.45,25.71 6.03,25.71 | R59.2 R57.2 | R63.2 R60.2 R59.2 | R59.2 8.59,25.72 C32.1 7.15,25.73 IC8.2 6.03,25.71 | R64.2 6.03,25.71
CV_IN_1
  Top 0.254: R11.2 5.4,83.82 4.45,84.77 4.45,87.95 8.89,92.39 8.89,96.52 10.79,98.42 31.43,98.42 39.05,90.81 J3.P3
FOO
  Top 0.254: IC3.2 R13.2 R17.1
FOO1
  Top 0.254: R23.1 R24.2 IC3.7
FOO2
  Top 0.254: R57.1 R53.2 IC7.2
FOO3
  Top 0.254: R63.1 R65.2 IC7.7
GND  (via drill 0.5)
  other vias: 55.24,89.22 55.88,79.38 55.88,26.04 55.24,35.56 55.24,56.52 45.09,25.08 48.9,18.41 48.9,71.75 45.09,78.42 43.18,1.27 53.34,1.27 57.78,3.81 57.78,12.7 57.78,22.86 43.18,105.41 53.98,105.41 57.78,102.87 48.26,12.7 48.26,53.34 48.26,63.5 48.26,84.45 48.26,93.98 45.72,36.51 42.55,78.74 42.86,25.08 22.23,35.88 22.23,89.22 16.83,90.49 16.83,87.95 15.88,93.66 20.64,97.47 25.08,82.87 9.84,79.06 8.57,76.52 25.08,80.33 25.08,76.52 13.34,73.98 27.94,86.68 16.83,61.91 16.83,59.05 18.73,73.34 21.27,56.83 26.67,60.01 19.37,88.27 16.51,70.17 19.68,70.17 19.37,59.05 14.92,56.83 10.48,49.21 24.13,48.9 16.83,37.15 16.83,34.61 9.84,24.77 8.57,26.99 8.57,23.18 25.08,26.99 25.08,23.18 25.08,29.53 32.07,35.56 18.73,20 12.7,20.64 16.83,8.26 16.83,5.08 19.37,5.08 16.83,16.51 24.13,40.32 20.32,44.45 11.43,17.78 19.68,16.83 16.51,11.75 22.23,7.3 19.37,34.92 17.46,95.57 1.27,102.55 1.27,93.98 1.27,83.82 1.27,73.66 1.27,63.5 1.27,52.7 1.27,43.18 1.27,33.02 1.27,22.86 1.27,12.7 1.27,3.81 7.62,1.27 32.07,83.19 33.97,83.19 32.07,78.74 33.97,78.74 33.97,73.66 32.07,73.66 32.07,86.68 33.97,86.68 33.02,54.61 36.2,47.62 33.97,35.56 32.07,29.84 33.97,29.84 32.07,25.4 33.97,25.4 32.07,20.32 33.97,20.32 38.1,52.7 33.02,63.5 31.43,100.97 26.67,6.67 15.88,84.14 11.11,83.19 15.88,31.11 11.43,29.84 8.89,73.34 27.94,78.74
  pour Bottom: 0,0 59.05,0 59.05,106.68 0,106.68
  pour Top (isolate 0.203): 0,0 59.05,0 59.05,106.68 0,106.68
N$1
  Top 0.254: R12.2 R15.2 47.65,80.64 IC2.3
N$2
  Top 0.254: IC10.8 IC10.9
N$3
  Top 0.254: J4.P3 39.05,77.47 36.83,75.25 R25.2
N$4  (via drill 0.5)
  Top 0.254: R27.2 R26.2 46.37,73.98 46.99,73.98 49.21,76.2 v50.8,76.2 | v54.93,76.2 54.61,76.52 54.61,79.06 54.36,79.31 IC2.5
  Bottom 0.254: v50.8,76.2 v54.93,76.2
N$5
  Top 0.254: R52.2 R55.2 47.65,27.3 IC6.3
N$6
  Top 0.254: R22.1 46.37,77.47 J5.P3
N$7  (via drill 0.5)
  Top 0.254: R2.1 54.29,98.11 54.93,98.74 v54.93,100.33
  Bottom 0.254: v54.93,100.33 54.93,102.55 53.34,104.14 J2.P3
N$8  (via drill 0.5)
  Top 0.254: R68.2 R67.2 46.37,20.64 47.31,20.64 49.53,22.86 v50.8,22.86 | v54.93,22.86 54.61,23.18 54.61,25.72 54.36,25.97 IC6.5
  Bottom 0.254: v50.8,22.86 v54.93,22.86
N$9  (via drill 0.5)
  Top 0.254: v26.67,84.45 17.78,84.45 17.14,83.82 17.14,80.64 16.83,80.33 IC3.3
  Bottom 0.254: v26.67,84.45 R1.P$2
N$10
  Top 0.254: C6.1 22.21,87.95 21.91,87.95 21.59,87.63 IC1.9 20,87.63 19.68,87.31 19.68,85.42 R9.1 R10.2
N$11
  Top 0.406: D2.A 6.03,104.46 6.67,103.82 JP5.1 JP5.2
N$12
  Top 0.406: JP5.10 JP5.9 18.41,104.14 P1.2
N$13
  Top 0.406: L1.2 24.58,104.46 P1.1
N$14
  Top 0.254: R11.1 8.89,83.83 R3.P$2
N$15
  Top 0.254: R8.2 24.17,86.73 R1.P$3
N$16
  Top 0.406: D2.C | D2.C 5.08,101.6 4.06,102.62 L2.2
N$17
  Top 0.254: R21.1 C13.1
N$18
  Top 0.254: IC2.1 48.53,81.92 49.53,81.92 50.8,83.19 LED1.K
N$19
  Top 0.254: IC2.2 49.85,81.28 53.34,84.77 LED1.A 53.34,90.17 53.66,90.49 R6.1
N$20
  Top 0.254: C9.1 9.86,81.6 R13.1
N$21
  Top 0.254: R16.1 42.86,80.66 42.86,82.23 41.91,83.19 J3.P2
N$22
  Top 0.254: IC1.13 | IC1.13 21.59,90.17 21.89,90.47 R5.1 | R4.2 19.68,92.38 19.68,90.49 20,90.17 IC1.13
N$23
  Top 0.254: J8.P3 52.07,49.85 54.29,47.62 R41.1
N$24
  Top 0.254: R21.2 22.53,76.49 R25.1 IC3.10
N$25
  Top 0.254: J2.P2 48.58,96.52 41.27,89.22 39.69,89.22 37.15,91.76 22.24,91.76 R5.2
N$26  (via drill 0.5)
  Top 0.254: IC3.6 16.83,76.52 17.14,76.2 17.14,71.75 17.78,71.12 25.4,71.12 v26.67,69.85
  Bottom 0.254: R28.P$2 v26.67,69.85
N$27
  Top 0.254: C17.1 R31.2 19.99,66.04 R30.1 | IC4.13 20,61.59 19.68,61.91 19.68,62.87 19.99,63.17 C17.1 | C17.1 R32.1
N$28  (via drill 0.5)
  Top 0.254: IC3.11 18.41,76.52 17.78,75.88 17.78,72.39 18.41,71.75 v28.89,71.75 | IC4.7 14.3,58.42 C18.2 13.97,55.88 15.88,53.98 26.04,53.98 29.17,57.11 R28.P$1
  Bottom 0.254: v28.89,71.75 28.89,63.5 29.17,63.22 R28.P$1
N$29  (via drill 0.5)
  Top 0.254: IC7.3 16.83,26.99 17.14,27.3 17.14,30.48 17.78,31.11 v26.67,31.11
  Bottom 0.254: v26.67,31.11 R40.P$2
N$30  (via drill 0.5)
  Top 0.254: IC5.1 13.98,37.47 C25.2 12.71,37.48 v12.7,37.47 | IC7.14 18.73,26.99 v18.1,27.62 17.78,27.94 17.78,29.84 18.41,30.48 25.72,30.48 26.04,30.16 v29.21,30.16
  Bottom 0.254: v18.1,27.62 17.78,27.62 17.14,27.62 13.34,31.43 13.34,36.83 v12.7,37.47 | R40.P$1 29.21,35.49 v29.21,30.16
N$32
  Top 0.254: R35.2 24.17,60.06 R28.P$3
N$33  (via drill 0.5)
  Top 0.254: IC10.7 13.98,4.76 C38.2 13.97,2.54 14.29,2.22 18.41,2.22 18.73,1.91 24.45,1.91 29.21,6.67 29.21,8.82 R69.P$1 | IC7.11 18.41,23.18 17.78,22.54 17.78,19.68 19.05,18.41 v28.89,18.41
  Bottom 0.254: v28.89,18.41 28.89,10.16 29.17,9.88 R69.P$1
N$34
  Top 0.254: R47.2 24.17,33.71 R40.P$3
N$35
  Top 0.254: LED2.K 50.8,60.96 53.98,64.14 53.98,73.98 53.34,74.61 53.34,78.42 52.7,79.06 52.7,80.64 53.35,81.29 IC2.7
N$36
  Top 0.254: IC2.6 53.66,80.64 53.34,80.33 53.34,79.38 53.98,78.74 53.98,74.93 54.61,74.3 54.61,63.82 53.34,62.55 LED2.A 53.34,55.55 R38.1
N$37
  Top 0.254: IC4.9 20.83,59.07 R36.2 R34.1
N$38
  Top 0.254: J5.P2 42.55,69.85 41.27,68.58 35.88,68.58 31.11,63.82 22.86,63.82 22.23,63.18 R34.2
N$39
  Top 0.254: R33.1 14.3,62.23 IC4.1 15.57,62.42 C42.2 R32.2
N$40
  Top 0.254: R37.1 8.89,57.16 R29.P$2
N$41
  Top 0.254: C14.1 9.86,75.25 R24.1
N$42  (via drill 0.5)
  Top 0.254: 13.65,77.79 IC3.5 | 13.65,77.79 R20.1 | v13.65,76.52 13.65,77.79 | v12.06,72.39 11.11,71.44 11.11,62.55 11.39,62.27 R29.P$1 11.42,59.39 C18.1 14.3,59.05 IC4.6
  Bottom 0.254: v13.65,76.52 12.06,74.93 v12.06,72.39
N$43  (via drill 0.5)
  Top 0.254: IC7.6 16.83,23.18 17.14,22.86 17.14,19.37 18.73,17.78 25.08,17.78 v26.67,16.19
  Bottom 0.254: R69.P$2 v26.67,16.19
N$44
  Top 0.254: J6.P3 37.15,64.14 26.35,53.34 15.56,53.34 11.75,57.15 R37.2
N$45
  Top 0.254: R58.1 C30.1
N$46
  Top 0.254: IC7.15 R54.1 22.53,27.02 R58.2
N$47
  Top 0.254: R18.1 C10.1
N$49
  Top 0.254: R50.2 R49.1 19.7,33.99 20,34.29 IC5.9 21.89,34.29 C26.1 22.56,34.29 22.86,34.29 23.18,33.97 23.18,33.02 23.5,32.7 26.04,32.7 26.35,33.02 R48.1
N$50
  Top 0.254: R56.1 42.86,27.32 42.86,28.57 41.59,29.84 J9.P2
N$51
  Top 0.254: R77.2 24.17,6.72 R69.P$3
N$52  (via drill 0.5)
  Top 0.254: R54.2 v38.42,28.26
  Bottom 0.254: v38.42,28.26 38.42,49.85 39.37,50.8 J7.P3
N$53  (via drill 0.5)
  Top 0.254: IC4.2 14.3,61.59 R33.2 13.35,61.26 12.22,62.39 | v18.1,77.79 IC3.12 | v15.24,71.12 11.75,67.63 11.75,62.87 12.22,62.39 | C42.1 13.65,63.82 12.22,62.39 | 12.22,62.39
  Bottom 0.254: v18.1,77.79 15.24,74.93 v15.24,71.12
N$55
  Top 0.254: R51.2 5.4,30.48 3.81,32.07 3.81,33.97 7.3,37.47 7.3,48.58 11.43,52.7 24.45,52.7 26.35,50.8 26.35,48.26 28.26,46.35 30.8,46.35 39.69,37.47 J9.P3
N$56  (via drill 0.5)
  Top 0.254: IC5.6 14.3,34.29 R46.2 13.18,34.62 | v18.1,26.35 18.73,25.72 IC7.13 | v12.38,34.61 12.4,34.62 13.18,34.62 | C43.1 13.49,32.23 13.18,32.54 13.18,34.62
  Bottom 0.254: v18.1,26.35 17.78,26.67 17.14,26.67 12.7,31.11 12.7,34.29 v12.38,34.61
N$58
  Top 0.254: IC6.1 48.53,28.57 49.21,28.57 50.8,30.16 LED3.K
N$59
  Top 0.254: IC6.2 49.53,27.94 53.34,31.75 LED3.A 53.34,36.53 R45.1
N$60
  Top 0.254: R43.2 19.67,37.16 20,36.83 IC5.13 21.59,36.83 21.89,37.13 R44.1
N$61
  Top 0.254: J8.P2 50.48,43.18 43.5,36.2 39.69,36.2 37.47,38.42 22.24,38.42 R44.2
N$62  (via drill 0.5)
  Top 0.254: 12.06,8.89 13.34,7.62 13.96,7.62 R76.2 14.3,7.94 IC10.2 | 12.06,8.89 11.75,9.21 11.75,14.61 13.65,16.51 14.92,16.51 v15.56,17.14 | v18.1,24.45 IC7.12 | C44.1 13.34,10.16 12.06,8.89
  Bottom 0.254: v15.56,17.14 15.56,21.91 v18.1,24.45
N$63
  Top 0.254: C29.1 9.86,28.26 R53.1
N$64
  Top 0.254: R39.1 42.86,53.99 42.86,55.24 41.59,56.52 J6.P2
N$65  (via drill 0.5)
  Top 0.254: IC1.2 14.62,90.17 C5.1 13.96,89.53 12.7,89.53 11.39,88.22 R3.P$1 | R19.1 13.65,79.06 | 13.65,79.06 IC3.4 | 13.65,79.06 v13.65,80.33
  Bottom 0.254: v13.65,80.33 13.65,82.55 11.39,84.81 R3.P$1
N$66  (via drill 0.5)
  Top 0.254: R14.2 v38.42,81.6
  Bottom 0.254: J1.P3 39.37,104.14 38.42,103.19 v38.42,81.6
N$67  (via drill 0.5)
  Top 0.254: R42.P$1 11.43,32.73 11.43,34.92 12.69,36.18 C25.1 14.62,36.83 IC5.2 | 13.65,25.72 IC7.4 | R59.1 13.65,25.72 | 13.65,25.72 v13.65,26.99
  Bottom 0.254: v13.65,26.99 13.65,29.21 11.39,31.47 R42.P$1
N$69
  Top 0.254: J10.P3 39.05,24.13 36.83,21.91 R66.2
N$70
  Top 0.254: R51.1 8.89,30.5 R42.P$2
N$71
  Top 0.254: R62.1 46.37,24.13 J11.P3
N$72
  Top 0.254: R61.1 C33.1
N$73
  Top 0.254: R61.2 22.54,21.92 R66.1 IC7.10
N$75
  Top 0.254: IC3.15 R14.1 22.53,80.36 R18.2
N$76
  Top 0.254: C37.1 R73.2 19.67,12.06 R71.1 | C37.1 R75.1 | IC10.13 20,7.94 19.67,8.27 C37.1
N$77
  Top 0.254: J12.P3 45.09,5.08 43.81,3.81 32.38,3.81 29.84,1.27 18.41,1.27 18.1,1.59 13.97,1.59 11.75,3.81 R79.2
N$84
  Top 0.254: LED4.K 50.8,7.62 53.98,10.79 53.98,20.64 53.34,21.27 53.34,25.08 52.7,25.72 52.7,27.3 53.35,27.95 IC6.7
N$85
  Top 0.254: IC6.6 53.66,27.3 53.34,26.99 53.34,26.04 53.98,25.4 53.98,21.59 54.61,20.95 54.61,10.48 53.34,9.21 LED4.A 56.5,6.35 R78.1
N$87  (via drill 0.5)
  Top 0.254: IC1.1 13.98,90.81 C5.2 12.71,90.82 v12.7,90.81 | IC3.14 18.73,80.33 v18.1,80.96 17.78,81.28 17.78,83.19 18.41,83.82 26.04,83.82 26.35,83.5 v29.21,83.5
  Bottom 0.254: v18.1,80.96 17.14,80.96 13.34,84.77 13.34,90.17 v12.7,90.81 | R1.P$1 29.21,88.83 v29.21,83.5
N$88
  Top 0.254: R76.1 14.3,8.57 IC10.1 15.41,8.61 C44.2 R75.2
N$89
  Top 0.254: R79.1 8.89,3.83 R70.P$2
N$90
  Top 0.254: C34.1 9.86,21.91 R65.1
N$91  (via drill 0.5)
  Top 0.254: 13.65,24.45 IC7.5 | IC10.6 14.62,5.4 C38.1 13.94,6.02 R70.P$1 11.39,8.61 11.11,8.89 11.11,14.92 v13.65,17.46 | 13.65,24.45 R60.1 | v13.65,23.18 13.65,24.45
  Bottom 0.254: v13.65,17.46 v13.65,23.18
N$96  (via drill 0.5)
  Top 0.254: IC1.6 14.3,87.63 R7.2 13.02,87.96 | v18.1,79.69 18.73,79.06 IC3.13 | v12.38,87.95 12.4,87.96 13.02,87.96 | 13.02,87.96 13.02,86.04 13.49,85.57 C41.1
  Bottom 0.254: v18.1,79.69 17.46,79.69 12.7,84.45 12.7,87.63 v12.38,87.95
N$100
  Top 0.254: R7.1 14.3,87 IC1.7 | IC1.7 | IC1.7 16.19,87 17.78,85.41 R9.2 | C41.2 15.38,85.57 IC1.7
N$103
  Top 0.254: R46.1 14.3,33.66 IC5.7 | IC5.7 15.88,33.66 17.46,32.07 R49.2 | C43.2 15.38,32.35 IC5.7
N$105
  Top 0.254: R72.1 39.37,11.75 37.47,9.84 J12.P2
OUT1
  Top 0.254: R12.1 46.04,82.25 46.04,84.45 | 46.04,84.45 46.04,86.36 51.75,92.08 53.98,92.08 54.29,92.39 R2.2 | 46.04,84.45 27.94,84.45 26.99,85.41 R10.1 22.23,85.42 C6.2 22.21,86.68 21.91,86.68 21.59,87 IC1.8
OUT2
  Top 0.203: 39.05,75.56 42.23,75.56 42.85,76.19 R22.2
  Top 0.254: 46.37,76.2 R22.2 R26.1 | IC4.14 20.95,62.37 20.95,62.87 21.29,63.2 C17.2 R31.1 31.43,65.09 36.83,70.48 36.83,73.66 38.73,75.56 39.05,75.56
OUT3
  Top 0.254: 46.04,31.11 27.94,31.11 26.99,32.07 R50.1 22.23,32.08 C26.2 21.89,33.66 IC5.8 | R52.1 46.04,28.91 46.04,31.11 | 46.04,31.11 46.04,33.02 51.75,38.73 53.98,38.73 54.29,39.05 R41.2
OUT4
  Top 0.254: R62.2 46.37,22.86 | R62.2 R67.1 | R62.2 44.75,22.84 44.13,22.23 39.69,22.23 35.56,18.1 35.56,16.19 30.8,11.43 R73.1 C37.2 20.97,8.73 IC10.14
VCC  (via drill 0.5)
  Top 0.254: C28.1 IC6.8 | C8.1 IC2.8 | IC1.4 17.14,88.9 17.78,89.53 17.78,92.08 17.46,92.39 C4.1 | IC5.4 16.83,35.56 17.78,36.51 17.78,38.1 17.48,38.4 C24.1 17.48,42.21 v17.14,42.55 | 22.54,82.88 C7.1 IC3.16 v18.73,82.87 | C4.1 17.3,92.54 v17.3,94.14 | C4.1 17.14,92.38 | IC4.4 17.14,60.33 17.78,59.69 17.78,58.1 17.48,57.8 C19.1 17.14,56.5 v17.14,55.56 | C27.1 IC7.16 v18.73,29.53 | IC10.4 16.83,6.67 17.8,5.7 17.8,4.14 17.78,4.13 17.14,4.13 16.21,3.19 C40.1 v17.46,3.17 | R74.1 35.24,8.89 v29.21,2.86
  Top 0.406: C28.1 55.88,30.16 56.83,31.11 56.83,81.6 56.5,81.93 C8.1 | C8.1 55.9,81.92 | C8.1 55.88,83.82 56.83,84.77 56.83,100.65 55.56,101.92 38.1,101.92 35.24,99.06 11.75,99.06 | 11.75,99.06 4.13,99.06 3.49,99.69 L2.1 | C2.+ 15.24,97.14 15.24,96.2 v17.3,94.14 | C2.+ | C2.+ v11.75,97.16 | v11.75,99.69 11.75,99.06 | v17.14,42.55 17.14,47.31 15.88,48.58 15.88,50.15 C21.+ 15.88,50.18 v15.88,51.75
  Bottom 0.254: 19.68,82.87 v18.73,82.87 | 17.78,55.56 v17.14,55.56 | 19.68,29.53 v18.73,29.53
  Bottom 0.406: v17.3,94.14 17.78,93.66 17.78,84.77 19.68,82.87 19.68,72.71 17.78,70.8 17.78,55.56 17.78,53.66 v15.88,51.75 | v11.75,97.16 v11.75,99.69 | v17.14,42.55 17.78,41.91 17.78,31.43 19.68,29.53 19.68,19.37 17.78,17.46 17.78,3.49 v17.46,3.17 18.41,3.17 19.68,1.91 28.26,1.91 v29.21,2.86
VEE  (via drill 0.5)
  Top 0.254: IC6.4 48.49,26.67 47.62,26.67 47.32,26.37 C31.2 | IC2.4 48.49,80.01 47.62,80.01 47.32,79.71 C11.2 | IC5.11 20,35.56 18.72,36.84 C23.2 18.73,40.34 18.73,42.23 v19.05,42.55 | v18.73,95.25 18.73,93.68 C3.2 18.72,92.69 18.41,92.39 18.41,90.49 20,88.9 IC1.11 | C15.2 21.27,72.69 | v22.54,72.71 C15.2 | C15.2 21.27,72.72 21.27,73.98 IC3.9 | IC4.11 19.05,60.33 18.41,59.69 18.41,58.42 18.73,58.1 18.73,56.85 C20.2 19.05,56.5 v19.05,55.56 | IC7.9 21.27,20.64 21.29,20.62 C35.2 v22.54,19.37 | IC10.11 19.37,6.67 18.41,5.71 18.41,4.45 18.72,4.14 C39.2 18.72,2.87 19.05,2.54 21.27,2.54 v21.59,2.86 | R64.1 6.03,20.64 7.62,19.05 15.88,19.05 19.05,15.88 v19.05,14.61 | IC1.11
  Top 0.406: 57.47,83.19 57.47,100.97 55.88,102.55 38.42,102.55 36.82,104.15 C1.- | 57.47,83.19 57.47,29.84 v57.15,29.84 | C31.2 47.64,26.04 49.53,26.04 53.34,29.84 v54.61,29.84 | C11.2 47.64,79.38 49.53,79.38 53.34,83.19 v54.93,83.19 | 57.47,83.19 v56.83,83.19 | C1.- 33.34,103.5 32.38,103.5 31.43,102.55 D1.A 30.16,101.91 29.53,101.28 25.4,101.28 25.08,101.6 24.29,101.6 v20.64,101.6 | v19.05,42.55 19.05,49.84 C22.- 18.73,50.18 v18.73,51.75 | L1.1 33.34,104.46 C1.-
  Bottom 0.254: 20.32,72.39 20.32,72.71 v22.54,72.71 | 18.41,55.56 v19.05,55.56 | 20.32,19.37 v22.54,19.37 | 18.41,14.61 v19.05,14.61
  Bottom 0.406: v57.15,29.84 v54.61,29.84 | v56.83,83.19 v54.93,83.19 | v20.64,101.6 18.73,99.69 v18.73,95.25 18.41,94.93 18.41,85.09 20.32,83.19 20.32,72.39 18.41,70.48 18.41,55.56 18.41,52.07 v18.73,51.75 | v19.05,42.55 18.41,41.91 18.41,31.75 20.32,29.84 20.32,19.37 20.32,19.05 18.41,17.14 18.41,14.61 18.41,4.13 20,2.54 21.27,2.54 v21.59,2.86

### Text on the board
bPlace: stripe | Red
bNames: +12V | GND | -12V | Veils | cc-by-sa | Émilie Gillet, | 2016. v4
tStop: Veils | cc-by-sa | Émilie Gillet | 2016. v4